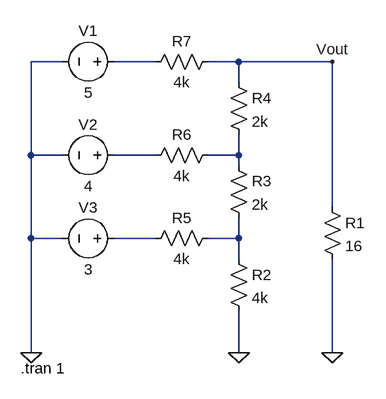
[diagram p0: schematic ladder.asc]
ladder.asc, the LTspice schematic file:
Version 4.1
SHEET 1 880 680
WIRE -80 -160 -128 -160
WIRE 64 -160 0 -160
WIRE 192 -160 144 -160
WIRE 336 -160 192 -160
WIRE 192 -128 192 -160
WIRE -128 -16 -128 -160
WIRE -80 -16 -128 -16
WIRE 64 -16 0 -16
WIRE 192 -16 192 -48
WIRE 192 -16 144 -16
WIRE 192 0 192 -16
WIRE 336 64 336 -160
WIRE -128 112 -128 -16
WIRE -80 112 -128 112
WIRE 64 112 0 112
WIRE 192 112 192 80
WIRE 192 112 144 112
WIRE 192 144 192 112
WIRE -128 288 -128 112
WIRE 192 288 192 224
WIRE 336 288 336 144
FLAG 192 288 0
FLAG 336 288 0
FLAG -128 288 0
FLAG 336 -160 Vout
SYMBOL res 320 48 R0
SYMATTR InstName R1
SYMATTR Value 16
SYMBOL res 176 -16 R0
SYMATTR InstName R3
SYMATTR Value 2k
SYMBOL res 176 -144 R0
SYMATTR InstName R4
SYMATTR Value 2k
SYMBOL res 176 128 R0
SYMATTR InstName R2
SYMATTR Value 4k
SYMBOL res 160 96 R90
WINDOW 0 0 56 VBottom 2
WINDOW 3 32 56 VTop 2
SYMATTR InstName R5
SYMATTR Value 4k
SYMBOL res 160 -32 R90
WINDOW 0 0 56 VBottom 2
WINDOW 3 32 56 VTop 2
SYMATTR InstName R6
SYMATTR Value 4k
SYMBOL res 160 -176 R90
WINDOW 0 0 56 VBottom 2
WINDOW 3 32 56 VTop 2
SYMATTR InstName R7
SYMATTR Value 4k
SYMBOL voltage 16 -160 R90
WINDOW 0 -32 56 VBottom 2
WINDOW 3 32 56 VTop 2
SYMATTR InstName V1
SYMATTR Value 5
SYMBOL voltage 16 -16 R90
WINDOW 0 -32 56 VBottom 2
WINDOW 3 32 56 VTop 2
SYMATTR InstName V2
SYMATTR Value 4
SYMBOL voltage 16 112 R90
WINDOW 0 -32 56 VBottom 2
WINDOW 3 32 56 VTop 2
SYMATTR InstName V3
SYMATTR Value 3
TEXT -144 312 Left 2 !.tran 1

The netlist it stands for:
* ladder.asc
R1 Vout 0 16
R3 N003 N005 2k
R4 Vout N003 2k
R2 N005 0 4k
R5 N005 N004 4k
R6 N003 N002 4k
R7 Vout N001 4k
V1 N001 0 5
V2 N002 0 4
V3 N004 0 3
.tran 1
.backanno
.end